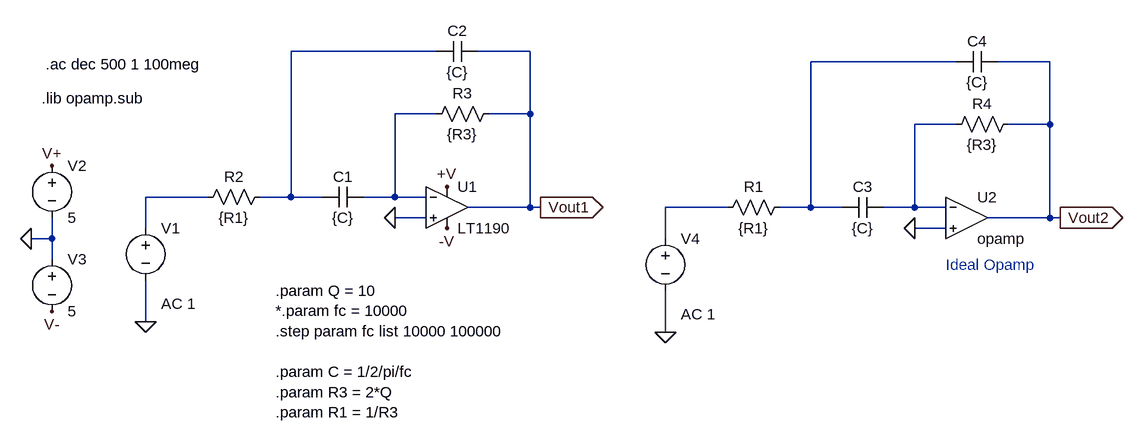
[diagram p0: schematic MFB.asc]
MFB.asc, the LTspice schematic file:
Version 4
SHEET 1 1836 680
WIRE 608 -176 384 -176
WIRE 752 -176 672 -176
WIRE 1408 -160 1184 -160
WIRE 1552 -160 1472 -160
WIRE 608 -80 544 -80
WIRE 752 -80 752 -176
WIRE 752 -80 688 -80
WIRE 1408 -64 1344 -64
WIRE 1552 -64 1552 -160
WIRE 1552 -64 1488 -64
WIRE 256 48 160 48
WIRE 384 48 384 -176
WIRE 384 48 336 48
WIRE 432 48 384 48
WIRE 544 48 544 -80
WIRE 544 48 496 48
WIRE 592 48 544 48
WIRE 752 64 752 -80
WIRE 752 64 656 64
WIRE 768 64 752 64
WIRE 1056 64 960 64
WIRE 1184 64 1184 -160
WIRE 1184 64 1136 64
WIRE 1232 64 1184 64
WIRE 1344 64 1344 -64
WIRE 1344 64 1296 64
WIRE 1392 64 1344 64
WIRE 592 80 544 80
WIRE 1552 80 1552 -64
WIRE 1552 80 1456 80
WIRE 1568 80 1552 80
WIRE 160 96 160 48
WIRE 1392 96 1344 96
WIRE 16 112 16 80
WIRE 16 112 -16 112
WIRE 960 112 960 64
WIRE 16 144 16 112
WIRE 160 240 160 176
WIRE 960 256 960 192
FLAG 160 240 0
FLAG 16 0 V+
FLAG 16 224 V-
FLAG 544 80 0
FLAG 624 32 +V
FLAG 624 96 -V
FLAG 768 64 Vout1
IOPIN 768 64 Out
FLAG -16 112 0
FLAG 960 256 0
FLAG 1344 96 0
FLAG 1568 80 Vout2
IOPIN 1568 80 Out
SYMBOL voltage 160 80 R0
WINDOW 123 24 132 Left 0
WINDOW 39 0 0 Left 0
SYMATTR Value2 AC 1
SYMATTR InstName V1
SYMATTR Value ""
SYMBOL voltage 16 -16 R0
WINDOW 123 0 0 Left 0
WINDOW 39 0 0 Left 0
SYMATTR InstName V2
SYMATTR Value 5
SYMBOL voltage 16 128 R0
WINDOW 123 0 0 Left 0
WINDOW 39 0 0 Left 0
SYMATTR InstName V3
SYMATTR Value 5
SYMBOL res 240 64 R270
WINDOW 0 32 56 VTop 0
WINDOW 3 0 56 VBottom 0
SYMATTR InstName R2
SYMATTR Value {R1}
SYMBOL cap 432 64 R270
WINDOW 0 32 32 VTop 0
WINDOW 3 0 32 VBottom 0
SYMATTR InstName C1
SYMATTR Value {C}
SYMBOL cap 608 -160 R270
WINDOW 0 32 32 VTop 0
WINDOW 3 0 32 VBottom 0
SYMATTR InstName C2
SYMATTR Value {C}
SYMBOL res 592 -64 R270
WINDOW 0 32 56 VTop 0
WINDOW 3 0 56 VBottom 0
SYMATTR InstName R3
SYMATTR Value {R3}
SYMBOL voltage 960 96 R0
WINDOW 123 24 132 Left 0
WINDOW 39 0 0 Left 0
SYMATTR Value2 AC 1
SYMATTR InstName V4
SYMATTR Value ""
SYMBOL res 1040 80 R270
WINDOW 0 32 56 VTop 0
WINDOW 3 0 56 VBottom 0
SYMATTR InstName R1
SYMATTR Value {R1}
SYMBOL cap 1232 80 R270
WINDOW 0 32 32 VTop 0
WINDOW 3 0 32 VBottom 0
SYMATTR InstName C3
SYMATTR Value {C}
SYMBOL cap 1408 -144 R270
WINDOW 0 32 32 VTop 0
WINDOW 3 0 32 VBottom 0
SYMATTR InstName C4
SYMATTR Value {C}
SYMBOL res 1392 -48 R270
WINDOW 0 32 56 VTop 0
WINDOW 3 0 56 VBottom 0
SYMATTR InstName R4
SYMATTR Value {R3}
SYMBOL Opamps\\opamp 1424 16 R0
SYMATTR InstName U2
SYMBOL Opamps\\LT1190 624 0 R0
SYMATTR InstName U1
TEXT 6 -156 Left 0 !.ac dec 500 1 100meg
TEXT 360 192 Left 0 !.param Q = 10\n*.param fc = 10000\n.step param fc list 10000 100000\n \n.param C = 1/2/pi/fc\n.param R3 = 2*Q\n.param R1 = 1/R3
TEXT 0 -104 Left 0 !.lib opamp.sub
TEXT 1392 152 Left 0 ;Ideal Opamp

The netlist it stands for:
* MFB.asc
V1 N005 0 AC 1
V2 V+ 0 5
V3 0 V- 5
R2 N005 N001 {R1}
C1 N001 N003 {C}
C2 N001 Vout1 {C}
R3 N003 Vout1 {R3}
V4 N006 0 AC 1
R1 N006 N002 {R1}
C3 N002 N004 {C}
C4 N002 Vout2 {C}
R4 N004 Vout2 {R3}
XU2 N004 0 Vout2 opamp Aol=100K GBW=10Meg  ; pins invin noninvin out
XU1 0 N003 +V -V Vout1 LT1190  ; pins In+ In- V+ V- OUT
.ac dec 500 1 100meg
.param Q = 10
*.param fc = 10000
.step param fc list 10000 100000
.param C = 1/2/pi/fc
.param R3 = 2*Q
.param R1 = 1/R3
.lib opamp.sub
* Ideal Opamp
.backanno
.end